# EAGLE design CDi (EAGLE 9.6.2)
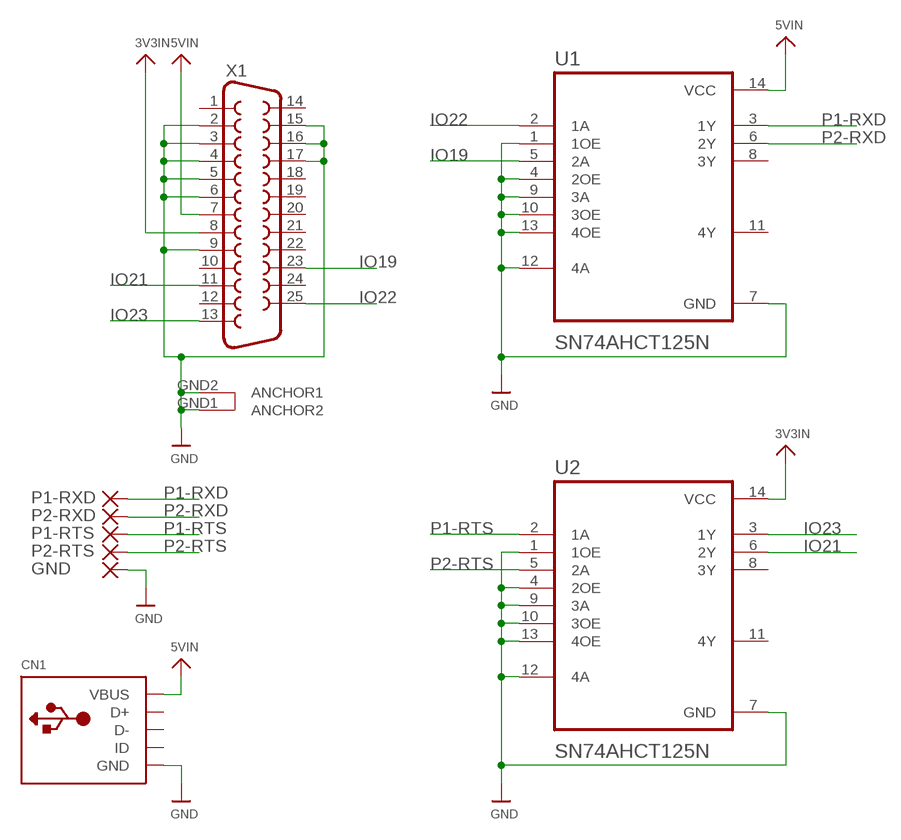
[diagram p0: schematic, sheet 1]

## Parts
CN1  USBTHM  [USB-MINIB-THM]
GND  SMD5  [SMD2,54-5,08]
P1-RTS  SMD5  [SMD2,54-5,08]
P1-RXD  SMD5  [SMD2,54-5,08]
P2-RTS  SMD5  [SMD2,54-5,08]
P2-RXD  SMD5  [SMD2,54-5,08]
U1  SN74AHCT125N  [DIP794W45P254L1969H508Q14]
U2  SN74AHCT125N  [DIP794W45P254L1969H508Q14]
X1  DB25_FEMALEHP  [F25HP]

## Nets
3V3IN: U2.14(VCC) X1.8
5VIN: CN1.VBUS U1.14(VCC) X1.7
GND: CN1.GND GND.1(P) U1.1(1OE) U1.4(2OE) U1.7(GND) U1.9(3A) U1.10(3OE) U1.12(4A) U1.13(4OE) U2.1(1OE) U2.4(2OE) U2.7(GND) U2.9(3A) U2.10(3OE) U2.12(4A) U2.13(4OE) X1.2 X1.3 X1.4 X1.5 X1.6 X1.9 X1.15 X1.16 X1.17 X1.GND1(ANCHOR2) X1.GND2(ANCHOR1)
IO19: U1.5(2A) X1.23
IO21: U2.6(2Y) X1.11
IO22: U1.2(1A) X1.25
IO23: U2.3(1Y) X1.13
P1-RTS: P1-RTS.1(P) U2.2(1A)
P1-RXD: P1-RXD.1(P) U1.3(1Y)
P2-RTS: P2-RTS.1(P) U2.5(2A)
P2-RXD: P2-RXD.1(P) U1.6(2Y)
Unconnected: CN1.D+ CN1.D- CN1.ID U1.8(3Y) U1.11(4Y) U2.8(3Y) U2.11(4Y) X1.1 X1.10 X1.12 X1.14 X1.18 X1.19 X1.20 X1.21 X1.22 X1.24

## Library data of the parts
CN1 = adafruit:USB: USB Connectors USBMINIB - Surface Mount Female Mini-B USB Connector 4UConnector: 06564 By microbuilder.eu Thru-hole RA Female Mini-B USB Connector 4UConnector: 18732 By ladyada.net
GND P1-RTS P1-RXD P2-RTS P2-RXD = wirepad:SMD5: SMD PAD
U1 U2 = SN74AHCT125N:SN74AHCT125N: None Check prices <https://pricing.snapeda.com/parts/SN74AHCT125N/Texas%20Instruments/view-part?ref=eda>; AVAILABILITY: In Stock; DESCRIPTION: Quadruple Bus Buffer Gates With 3-State Outputs 14-PDIP -40 to 125; MF: Texas Instruments; MP: SN74AHCT125N; PACKAGE: PDIP-14 Texas Instruments; PRICE: None; PURCHASE-URL: https://pricing.snapeda.com/search/part/SN74AHCT125N/?ref=eda
X1 = SparkFun-Retired:DB25_FEMALE: 25 Pin male connector. PCB edge mount for regular PCB thicknesses. This connector will connect directly to the back of a PC parallel port or through a normal DB25 extension cable (M/F). SKU: PRT-08287

## Board
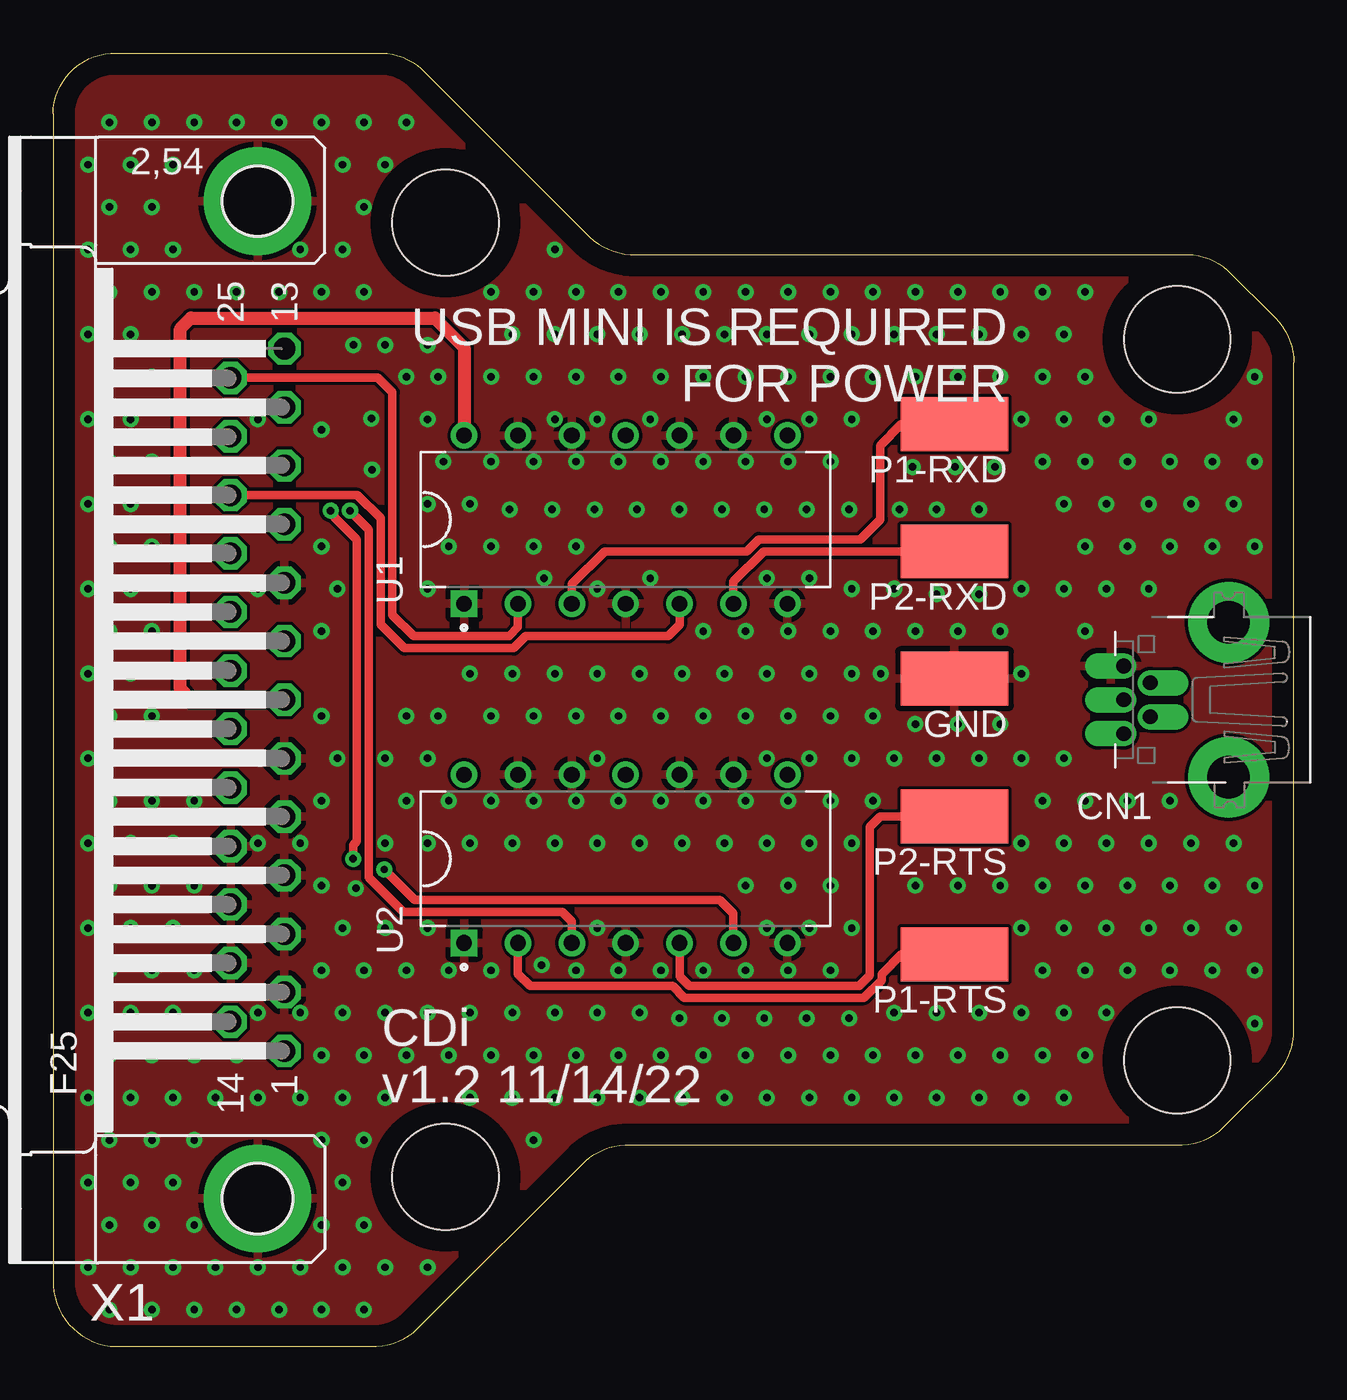
[diagram p1: board, top side]
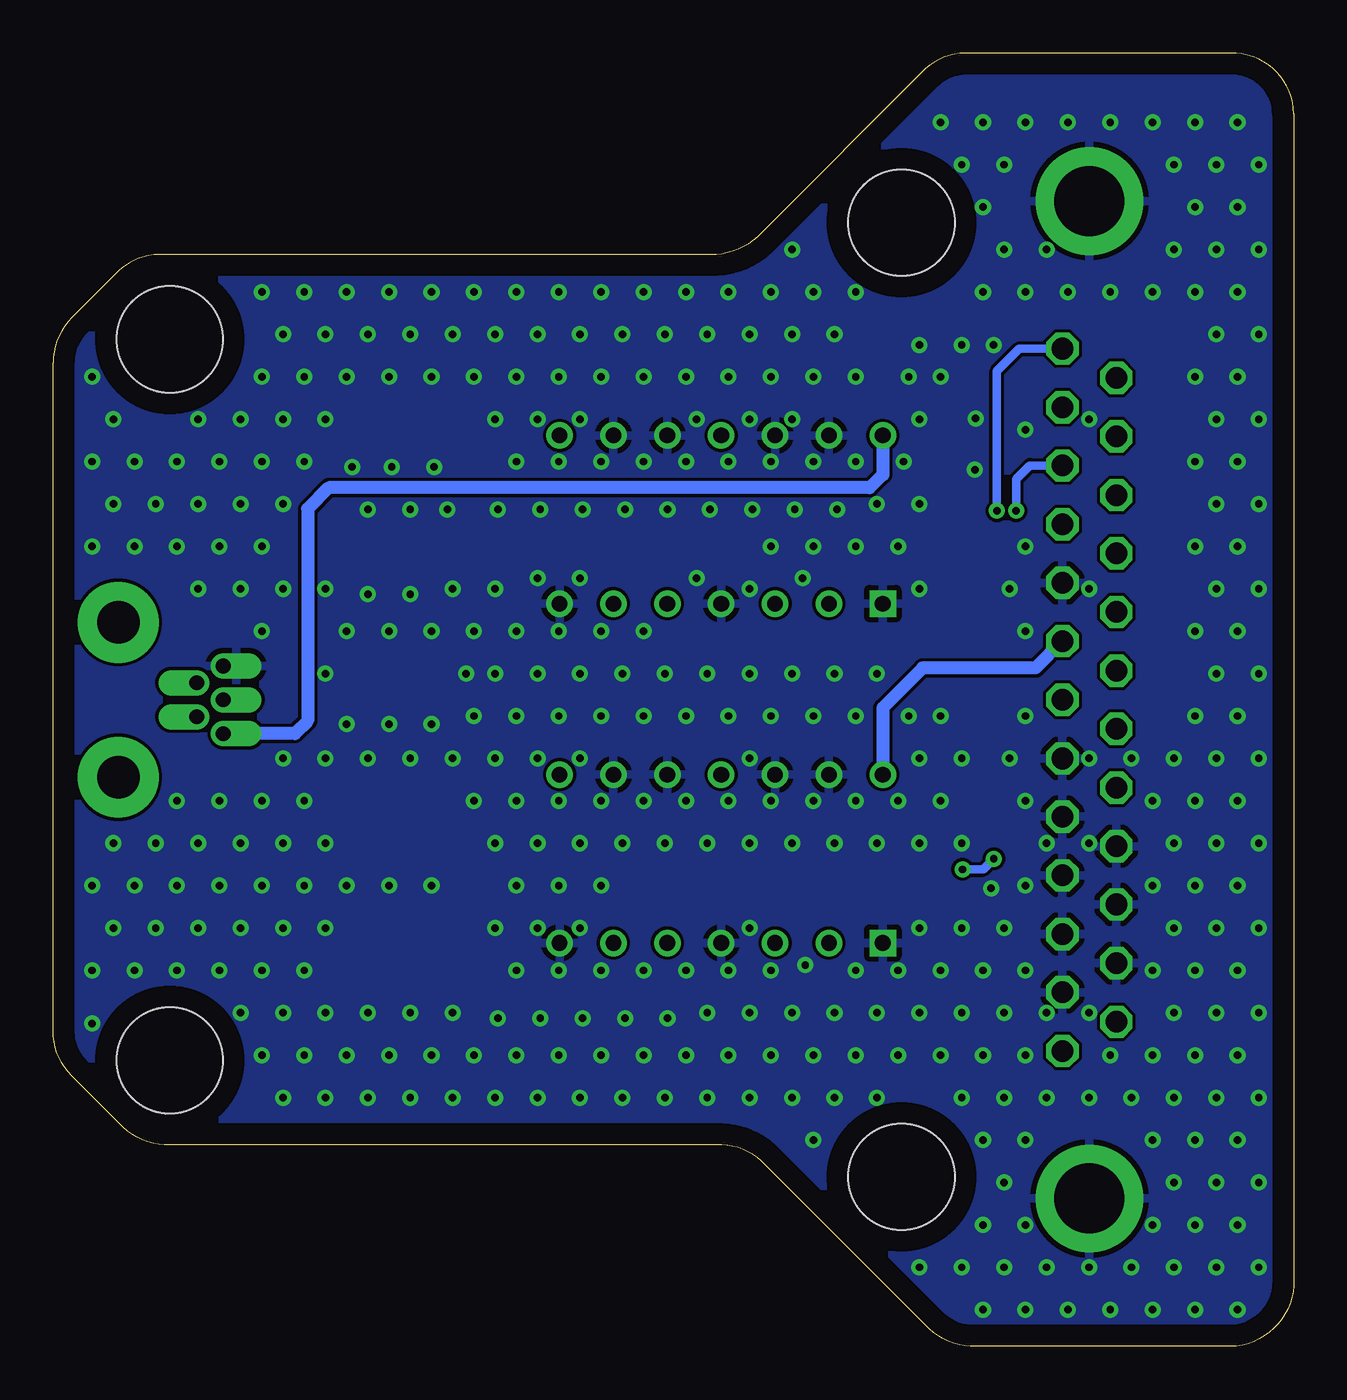
[diagram p2: board, bottom side, seen from below]

Size 58.5 x 61 mm. Coordinates in mm from the lower left corner, seen from the top.
Outline: 0,58.14 0,3.14 arc90 2.99,0 15.25,0 arc45 17.37,1.02 25.11,8.76 arc-45 27.23,9.5 53.25,9.5 arc45 55.37,10.52 57.61,12.76 arc45 58.5,14.88 58.5,46.4 arc45 57.61,48.52 55.37,50.76 arc45 53.25,51.5 27.23,51.5 arc-45 25.11,52.52 17.37,60.26 arc45 15.25,61 2.99,61 arc90 0,58.14
Copper layers (1*16): Top 0.035mm / dielectric 1.5mm / Bottom 0.035mm
Design rules "default": minimum track width 6mil, minimum drill 0.35mm, track to track 6mil, track to pad 6mil, pad to pad 6mil, via to via 6mil, smd to smd 6mil, copper to edge 40mil, drill to drill 6mil, minimum pad ring 10mil, minimum via ring 8mil, stop-mask expansion 4mil, vias tented up to drill 0.5mm, thermal gap 10mil
Holes 5 mm at 53,13.5 53,47.5 18.5,53 18.5,8

### Footprints (pad centres in the part's own frame; a part is rotated, then mirrored left to right if it is on the bottom)
USB-MINIB-THM = drill 0.7 offset: D+ 0,8.9; D- -0.8,7.65; GND 1.6,8.9; ID 0.8,7.65; VBUS -1.6,8.9 | drill 2 pad 3.81: GND1 -3.65,3.95; GND4 3.65,3.95
SMD2,54-5,08 = smd 2.54 x 5.08: 1 0,0
DIP794W45P254L1969H508Q14 = drill 0.74 pad 1.14 square: 1 -3.97,7.62 | drill 0.74 pad 1.14: 2 -3.97,5.08; 3 -3.97,2.54; 4 -3.97,0; 5 -3.97,-2.54; 6 -3.97,-5.08; 7 -3.97,-7.62; 8 3.97,-7.62; 9 3.97,-5.08; 10 3.97,-2.54; 11 3.97,0; 12 3.97,2.54; 13 3.97,5.08; 14 3.97,7.62
F25HP = drill 1.016 octagon: 1 -16.561,-1.27; 2 -13.792,-1.27; 3 -11.049,-1.27; 4 -8.28,-1.27; 5 -5.512,-1.27; 6 -2.769,-1.27; 7 0,-1.27; 8 2.769,-1.27; 9 5.512,-1.27; 10 8.28,-1.27; 11 11.049,-1.27; 12 13.792,-1.27; 13 16.561,-1.27; 14 -15.189,1.27; 15 -12.421,1.27; 16 -9.652,1.27; 17 -6.909,1.27; 18 -4.14,1.27; 19 -1.372,1.27; 20 1.372,1.27; 21 4.14,1.27; 22 6.909,1.27; 23 9.652,1.27; 24 12.421,1.27; 25 15.189,1.27 | drill 3.302 pad 5.08: GND1 -23.52,0; GND2 23.52,0

### Placement (x,y rotation side)
CN1  59.37,30.5 90 top
GND  42.5,31.5 90 top
P1-RTS  42.5,18.5 90 top
P1-RXD  42.5,43.5 90 top
P2-RTS  42.5,25 90 top
P2-RXD  42.5,37.5 90 top
U1  27,39 90 top
U2  27,23 90 top
X1  9.64,30.5 90 top

### Tracks (layer width: path | path; a pad name or v marks a point on that pad's centre or on a via)
3V3IN
  Bottom 0.61: X1.8 12.18,32 17.5,32 19.38,30.12 U2.14
5VIN
  Top 0.61: X1.7 6.5,30.5 6,31 6,48 6.5,48.5 18,48.5 19.38,47.12 U1.14
  Bottom 0.61: U1.14 19.38,41.12 20,40.5 45.5,40.5 46.5,39.5 46.5,29.5 47.1,28.9 CN1.VBUS
GND  (via drill 0.35)
  other vias: 2.66,1.74 1.66,3.74 2.66,5.74 1.66,7.74 2.66,9.74 1.66,11.74 2.66,13.74 1.66,15.74 2.66,17.74 1.66,19.74 2.66,21.74 1.66,23.74 2.66,25.74 1.66,27.74 2.66,29.74 1.66,31.74 2.66,33.74 1.66,35.74 2.66,37.74 1.66,39.74 2.66,41.74 1.66,43.74 2.66,45.74 1.66,47.74 2.66,49.74 1.66,51.74 2.66,53.74 1.66,55.74 2.66,57.74 4.66,1.74 3.66,3.74 4.66,5.74 3.66,7.74 4.66,9.74 3.66,11.74 4.66,13.74 3.66,15.74 4.66,17.74 3.66,19.74 4.66,21.74 3.66,23.74 4.66,25.74 3.66,27.74 4.66,29.74 3.66,31.74 4.66,33.74 3.66,35.74 4.66,37.74 3.66,39.74 4.66,41.74 3.66,43.74 4.66,45.74 3.66,47.74 4.66,49.74 3.66,51.74 4.66,53.74 3.66,55.74 4.66,57.74 6.66,1.74 5.66,3.74 6.66,5.74 5.66,7.74 6.66,9.74 5.66,11.74 6.66,13.74 5.66,15.74 6.66,17.74 5.66,19.74 6.66,21.74 5.66,23.74 6.66,25.74 5.66,27.74 6.66,49.74 5.66,51.74 5.66,55.74 6.66,57.74 8.66,1.74 7.66,3.74 7.66,11.74 8.66,13.74 7.66,27.74 8.66,49.74 8.66,57.74 10.66,1.74 9.66,3.74 9.66,11.74 9.66,15.74 9.66,23.74 9.66,27.74 9.66,35.74 9.66,43.74 10.66,49.74 10.66,57.74 12.66,1.74 11.66,3.74 12.66,5.74 12.66,9.74 11.66,11.74 12.66,13.74 11.66,15.74 12.66,17.74 12.66,21.74 11.66,23.74 12.66,25.74 12.66,29.74 12.66,33.74 12.66,37.74 12.66,49.74 11.66,51.74 12.66,57.74 14.66,1.74 13.66,3.74 14.66,5.74 13.66,7.74 14.66,9.74 13.66,11.74 14.66,13.74 13.66,15.74 14.66,17.74 13.66,19.74 14.28,21.61 13.4,27.74 13.4,35.74 15.04,41.35 14.16,47.24 14.66,49.74 13.66,51.74 14.66,53.74 13.66,55.74 14.66,57.74 15.66,3.74 15.66,11.74 16.66,13.74 15.66,15.74 16.66,17.74 15.66,19.74 15.66,23.74 16.66,25.74 15.66,27.74 16.66,29.74 12.66,43.24 15.01,43.77 16.66,45.74 15.66,47.24 15.66,55.74 16.66,57.74 17.66,3.74 18.66,13.74 17.66,15.74 18.66,17.74 17.66,19.74 17.66,23.74 18.66,25.74 17.66,27.74 18.16,29.74 17.66,35.74 18.66,37.74 17.66,39.74 18.4,41.74 17.66,43.74 18.16,45.74 17.66,47.24 19.66,11.74 20.66,13.74 19.66,15.74 20.66,17.74 19.66,23.74 20.66,25.74 20.66,29.74 19.66,31.74 20.66,37.74 19.66,39.74 20.66,41.74 20.66,45.74 20.66,49.74 22.66,9.74 21.66,11.74 22.66,13.74 21.66,15.74 23.04,17.99 21.66,23.74 22.66,25.74 22.66,29.74 21.66,31.74 22.66,37.74 21.53,39.48 22.66,41.74 22.66,45.74 21.66,47.74 22.66,49.74 23.66,11.74 24.66,13.74 23.66,15.74 24.66,17.74 23.66,23.74 24.66,25.74 24.66,29.74 23.66,31.74 23.16,36.24 24.66,37.74 23.53,39.48 24.66,41.74 23.66,43.74 24.66,45.74 23.66,47.74 24.66,49.74 23.66,51.74 25.66,11.74 26.66,13.74 25.66,15.74 26.66,17.74 25.66,19.74 25.66,23.74 26.66,25.74 25.66,27.74 26.66,29.74 25.66,31.74 25.66,35.74 25.53,39.48 26.66,41.74 25.66,43.74 26.66,45.74 25.66,47.74 26.66,49.74 27.66,11.74 28.66,13.74 27.66,15.74 28.66,17.74 27.66,23.74 28.66,25.74 28.66,29.74 27.66,31.74 28.16,36.24 27.53,39.48 28.66,41.74 28.16,43.74 28.66,45.74 27.66,47.74 28.66,49.74 29.66,11.74 30.66,13.74 29.53,15.48 30.66,17.74 29.66,23.74 30.66,25.74 30.66,29.74 29.66,31.74 30.66,33.74 29.53,39.48 30.66,41.74 30.66,45.74 29.66,47.74 30.66,49.74 31.66,11.74 32.66,13.74 31.53,15.48 32.66,17.74 32.66,21.74 31.66,23.74 32.66,25.74 32.66,29.74 31.66,31.74 32.66,33.74 31.53,39.48 32.66,41.74 32.66,45.74 31.66,47.74 32.66,49.74 33.66,11.74 34.66,13.74 33.53,15.48 34.66,17.74 33.66,19.74 34.66,21.74 33.66,23.74 34.66,25.74 33.66,27.74 34.66,29.74 33.66,31.74 34.66,33.74 33.66,36.24 33.53,39.48 34.66,41.74 33.66,43.74 34.66,45.74 33.66,47.74 34.66,49.74 35.66,11.74 36.66,13.74 35.53,15.48 36.66,17.74 35.66,19.74 36.66,21.74 35.66,23.74 36.66,25.74 35.66,27.74 36.66,29.74 35.66,31.74 36.66,33.74 35.66,36.24 35.53,39.48 36.66,41.74 35.66,43.74 36.66,45.74 35.66,47.74 36.66,49.74 37.66,11.74 38.66,13.74 37.53,15.48 37.66,19.74 37.66,23.74 38.66,25.74 37.66,27.74 38.66,29.74 37.66,31.74 38.66,33.74 37.66,35.74 37.53,39.48 37.66,43.74 38.66,45.74 37.66,47.74 38.66,49.74 39.66,11.74 40.66,13.74 39.66,15.74 40.66,21.74 39.66,27.74 40.66,29.35 39.02,31.74 40.66,33.74 39.66,35.74 39.91,39.48 40.53,41.48 40.66,45.74 39.66,47.74 40.66,49.74 41.66,11.74 42.66,13.74 41.66,15.74 42.66,21.74 41.66,27.74 42.66,29.35 42.66,33.74 41.66,35.48 41.66,39.48 42.53,41.48 42.66,45.74 41.66,47.74 42.66,49.74 43.66,11.74 44.66,13.74 43.66,15.74 44.66,21.74 43.66,27.74 44.66,29.35 44.66,33.74 43.66,35.48 43.66,39.48 44.4,41.48 44.66,45.74 43.66,47.74 44.66,49.74 45.66,11.74 46.66,13.74 45.66,15.74 46.66,17.74 45.66,19.74 46.66,21.74 45.66,23.74 46.66,25.74 45.66,27.74 45.66,31.74 45.66,35.74 46.66,41.74 45.66,43.74 46.66,45.74 45.66,47.74 46.66,49.74 47.66,11.74 48.66,13.74 47.66,15.74 48.66,17.74 47.66,19.74 48.66,21.74 47.66,23.74 48.66,25.74 47.66,27.74 48.66,33.74 47.66,35.74 48.66,37.74 47.66,39.74 48.66,41.74 47.66,43.74 48.66,45.74 47.66,47.74 48.66,49.74 49.66,15.74 50.66,17.74 49.66,19.74 50.66,21.74 49.66,23.74 50.66,37.74 49.66,39.74 50.66,41.74 49.66,43.74 52.66,17.74 51.66,19.74 52.66,21.74 51.66,23.74 52.66,37.74 51.66,39.74 52.66,41.74 51.66,43.74 54.66,17.74 53.66,19.74 54.66,21.74 53.66,23.74 50.66,25.74 49.66,35.74 54.66,37.74 53.66,39.74 54.66,41.74 56.66,15.24 56.66,17.74 55.66,19.74 56.66,21.74 55.66,23.74 52.66,25.74 51.66,35.74 56.66,37.74 55.66,39.74 56.66,41.74 55.66,43.74 56.66,45.74
  pour Top: 0,0 0,61 28.49,61 28.49,51.64 58.99,51.64 58.99,9.5 27.99,9.5 27.99,0
  pour Bottom: 0,0 0,61 28.49,61 28.49,51.64 58.99,51.64 58.99,9.5 27.99,9.5 27.99,0
IO19
  Top 0.406: U1.5 29.54,34.04 29,33.5 22.29,33.5 21.73,32.94 16.56,32.94 15.44,34.06 15.44,39.06 14.35,40.15 X1.23
IO21  (via drill 0.35)
  Top 0.406: v13.09,39.42 13.27,39.24 13.27,39.11 14.32,38.06 14.32,23.82 14.15,23.65 v14.15,23 | U2.6 32.08,20.42 31.44,21.06 17.06,21.06 v15.62,22.5
  Bottom 0.406: v13.09,39.42 13.09,40.91 12.45,41.55 X1.11 | v15.62,22.5 14.65,22.5 v14.15,23
IO22
  Top 0.406: U1.2 21.92,33.92 21.5,33.5 17,33.5 16,34.5 16,45 15.31,45.69 X1.25
IO23  (via drill 0.35)
  Top 0.406: U2.3 24.46,20.04 24,20.5 16.5,20.5 14.88,22.12 14.88,38.54 v14,39.42
  Bottom 0.406: v14,39.42 14,46 12.94,47.06 X1.13
P1-RTS
  Top 0.406: U2.2 21.92,17.58 22.5,17 29.21,17 29.77,16.44 38.23,16.44 39.06,17.27 39.06,17.56 40,18.5 P1-RTS.1
P1-RXD
  Top 0.406: U1.3 24.46,35.96 26,37.5 32.71,37.5 33.27,38.06 38.06,38.06 39,39 39,42.5 40,43.5 P1-RXD.1
P2-RTS
  Top 0.406: U2.5 29.54,17.46 30,17 38,17 38.5,17.5 38.5,24.5 39,25 P2-RTS.1
P2-RXD
  Top 0.406: U1.6 32.08,36.08 33.5,37.5 P2-RXD.1

### Text on the board
tPlace: USB MINI IS REQUIRED / FOR POWER | CDi / v1.2 11/14/22